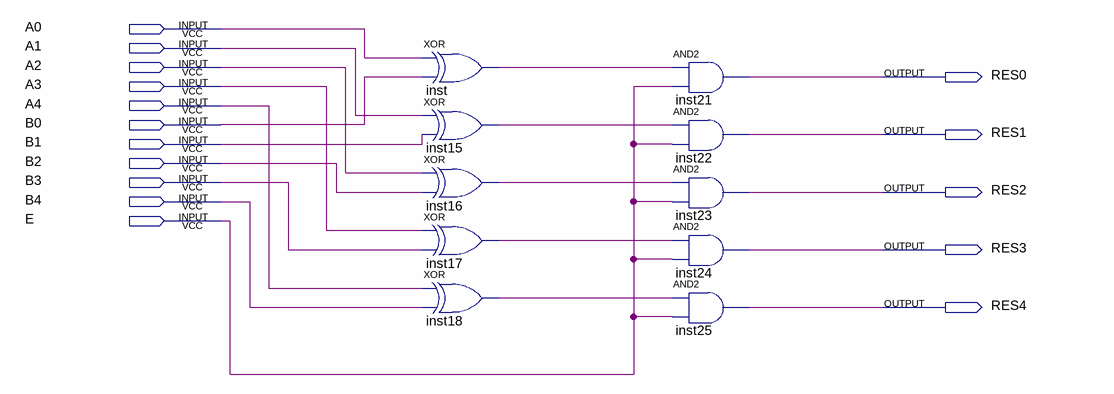
[diagram p0: schematic sheet]
// Quartus schematic XOR_BITS.bdf as structural Verilog: 10 symbols, 16 pins
module XOR_BITS (
  input  A0,
  input  A1,
  input  A2,
  input  A3,
  input  A4,
  input  B0,
  input  B1,
  input  B2,
  input  B3,
  input  B4,
  input  E,
  output RES0,
  output RES1,
  output RES2,
  output RES3,
  output RES4
);

  wire inst15_out, inst16_out, inst17_out, inst18_out, inst_out;

  xor inst (inst_out, A0, B0);
  xor inst15 (inst15_out, A1, B1);
  xor inst16 (inst16_out, A2, B2);
  xor inst17 (inst17_out, A3, B3);
  xor inst18 (inst18_out, A4, B4);
  and inst21 (RES0, inst_out, E);
  and inst22 (RES1, inst15_out, E);
  and inst23 (RES2, inst16_out, E);
  and inst24 (RES3, inst17_out, E);
  and inst25 (RES4, inst18_out, E);
endmodule
